# EAGLE design Sensor (EAGLE 7.3.0)
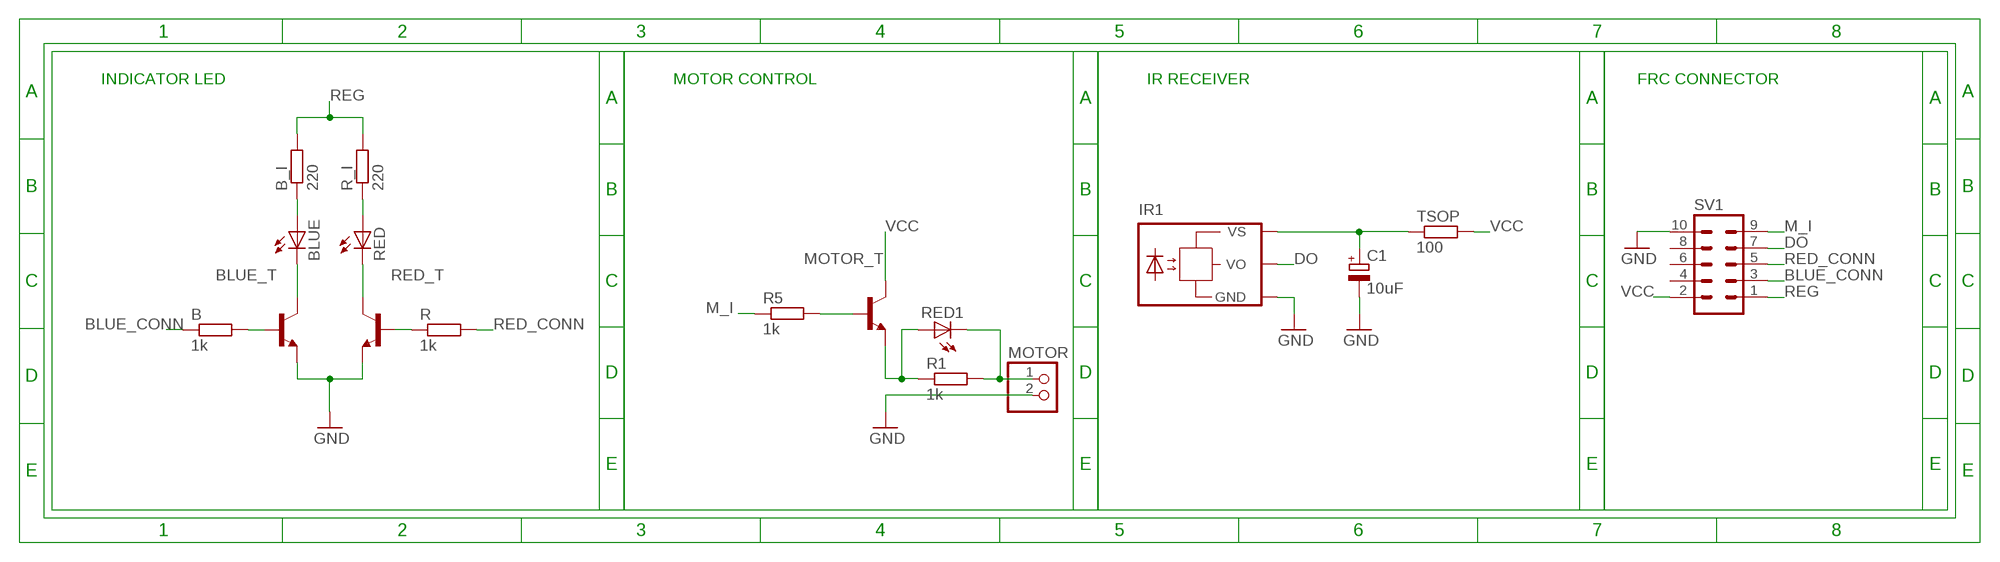
[diagram p0: schematic, sheet 1]

## Parts
B  1k  R-EU_0207/12  [0207/12]
B_I  220  R-EU_0207/12  [0207/12]
BLUE  LED5MM  [LED5MM]
BLUE_T  BC547  [TO92]
C1  10uF  CPOL-EUE2.5-6  [E2,5-6]
IR1  TSOP1730TB1  [TSOP17_TB1]
MOTOR  PINHD-1X2  [1X02]
MOTOR_T  BC547  [TO92]
R  1k  R-EU_0207/12  [0207/12]
R1  1k  R-EU_0207/12  [0207/12]
R5  1k  R-EU_0207/12  [0207/12]
R_I  220  R-EU_0207/12  [0207/12]
RED  LED5MM  [LED5MM]
RED1  LEDSMT1206  [1206]
RED_T  BC547  [TO92]
SV1  ML10  [ML10]
TSOP  100  R-EU_0207/12  [0207/12]

## Nets
BLUE_CONN: B.1 SV1.3
DO: IR1.VO SV1.7
GND: BLUE_T.1(E) C1.- IR1.GND MOTOR.2 RED_T.1(E) SV1.10
M_I: R5.1 SV1.9
N$1: B_I.1 BLUE.A
N$2: C1.+ IR1.VS TSOP.1
N$3: BLUE.K(C) BLUE_T.3(C)
N$4: RED.K(C) RED_T.3(C)
N$5: MOTOR_T.2(B) R5.2
N$6: MOTOR_T.1(E) R1.1 RED1.A
N$7: B.2 BLUE_T.2(B)
N$8: R.1 RED_T.2(B)
N$9: MOTOR.1 R1.2 RED1.C
R_I: R_I.1 RED.A
RED_CONN: R.2 SV1.5
REG: B_I.2 R_I.2 SV1.1
VCC: MOTOR_T.3(C) SV1.2 TSOP.2
Unconnected: SV1.4 SV1.6 SV1.8

## Notes on the sheet
- INDICATOR LED | MOTOR CONTROL | IR RECEIVER | FRC CONNECTOR

## Library data of the parts
B B_I R R1 R5 R_I TSOP = rcl:R-EU_: RESISTOR, European symbol
BLUE RED RED1 = led:LED: LED OSRAM: - CHIPLED LG R971, LG N971, LY N971, LG Q971, LY Q971, LO R971, LY R971 LH N974, LH R974 LS Q976, LO Q976, LY Q976 LO Q996 - Hyper CHIPLED LW Q18S LB Q993, LB Q99A, LB R99A - SideLED LS A670, LO A670, LY A670, LG A670, LP A670 LB A673, LV A673, LT A673, LW A673 LH A674 LY A675 LS A676, LA A676, LO A676, LY A676, LW A676 LS A679, LY A679, LG A679 - Hyper Micro SIDELED® LS Y876, LA Y876, LO Y876, LY Y876 LT Y87S - SmartLED LW L88C, LW L88S LB L89C, LB L89S, LG L890 LS L89K, LO L89K, LY L89K LS L896, LA L896, LO L896, LY L896 - TOPLED LS T670, LO T670, LY T670, LG T670, LP T670 LSG T670, LSP T670, LSY T670, LOP T670, LYG T670 LG T671, LOG T671, LSG T671 LB T673, LV T673, LT T673, LW T673 LH T674 LS T676, LA T676, LO T676, LY T676, LB T676, LH T676, LSB T676, LW T676 LB T67C, LV T67C, LT T67C, LS T67K, LO T67K, LY T67K, LW E67C LS E67B, LA E67B, LO E67B, LY E67B, LB E67C, LV E67C, LT E67C LW T67C LS T679, LY T679, LG T679 LS T770, LO T770, LY T770, LG T770, LP T770 LB T773, LV T773, LT T773, LW T773 LH T774 LS E675, LA E675, LY E675, LS T675 LS T776, LA T776, LO T776, LY T776, LB T776 LHGB T686 LT T68C, LB T68C - Hyper Mini TOPLED® LB M676 - Mini TOPLED Santana® LG M470 LS M47K, LO M47K, LY M47K Source: http://www.osram.convergy.de LUXEON: - LUMILED® LXK2-PW12-R00, LXK2-PW12-S00, LXK2-PW14-U00, LXK2-PW14-V00 LXK2-PM12-R00, LXK2-PM12-S00, LXK2-PM14-U00 LXK2-PE12-Q00, LXK2-PE12-R00, LXK2-PE12-S00, LXK2-PE14-T00, LXK2-PE14-U00 LXK2-PB12-K00, LXK2-PB12-L00, LXK2-PB12-M00, LXK2-PB14-N00, LXK2-PB14-P00, LXK2-PB14-Q00 LXK2-PR12-L00, LXK2-PR12-M00, LXK2-PR14-Q00, LXK2-PR14-R00 LXK2-PD12-Q00, LXK2-PD12-R00, LXK2-PD12-S00 LXK2-PH12-R00, LXK2-PH12-S00 LXK2-PL12-P00, LXK2-PL12-Q00, LXK2-PL12-R00 Source: www.luxeon.com KINGBRIGHT: KA-3528ASYC Source: www.kingbright.com
BLUE_T MOTOR_T RED_T = transistor:BC547: NPN TRANSISTOR
C1 = resistor:CPOL-EU: POLARIZED CAPACITOR, European symbol
IR1 = telefunken:TSOP17*TB1: TSOP17..TB1 IR Receiver Modules for Remote Control Systems Source: http://www.vishay.com/docs/82042/82042.pdf; OC_FARNELL: unknown; OC_NEWARK: unknown
MOTOR = pinhead:PINHD-1X2: PIN HEADER
SV1 = con-harting-ml:ML10: HARTING; OC_FARNELL: unknown; OC_NEWARK: unknown

## Board
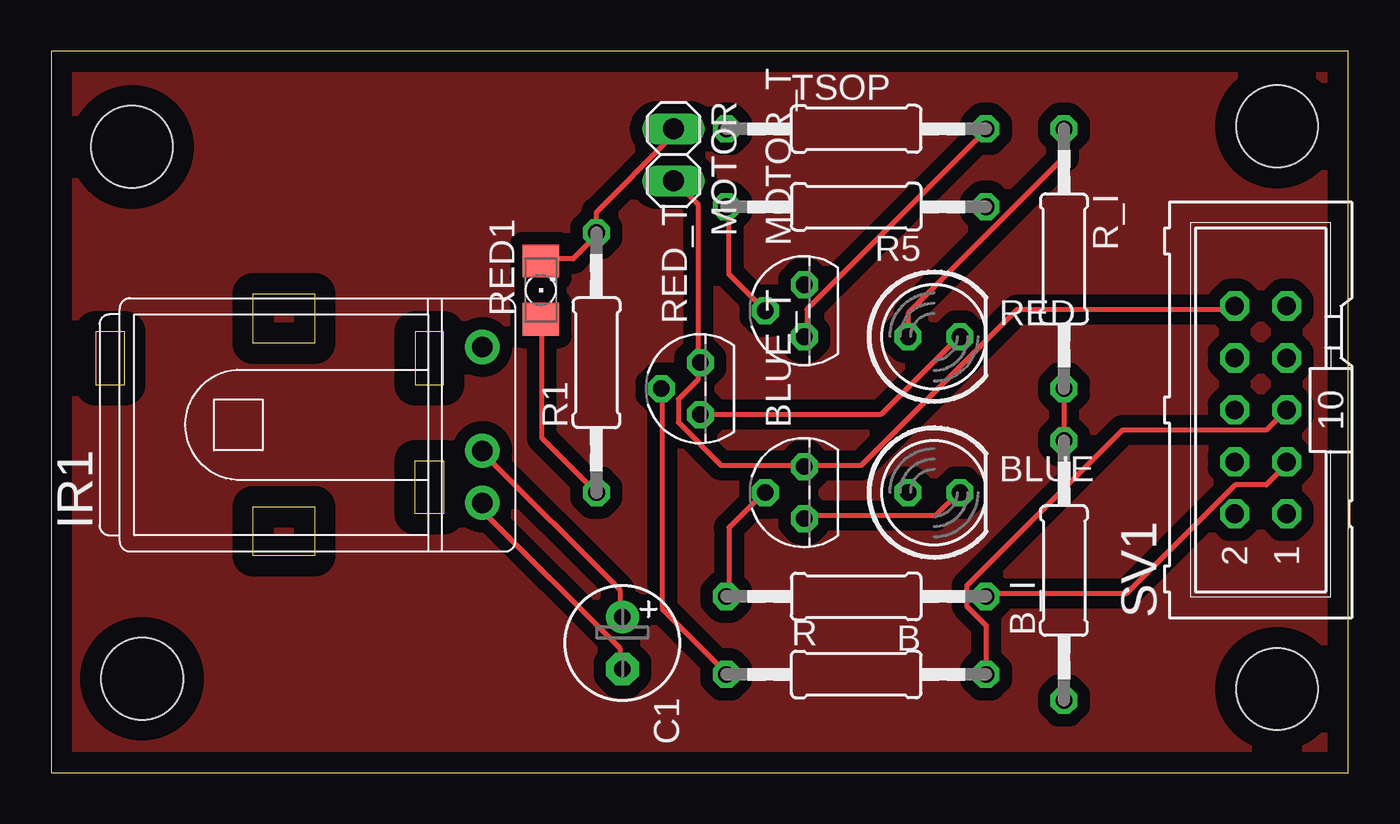
[diagram p1: board, top side]
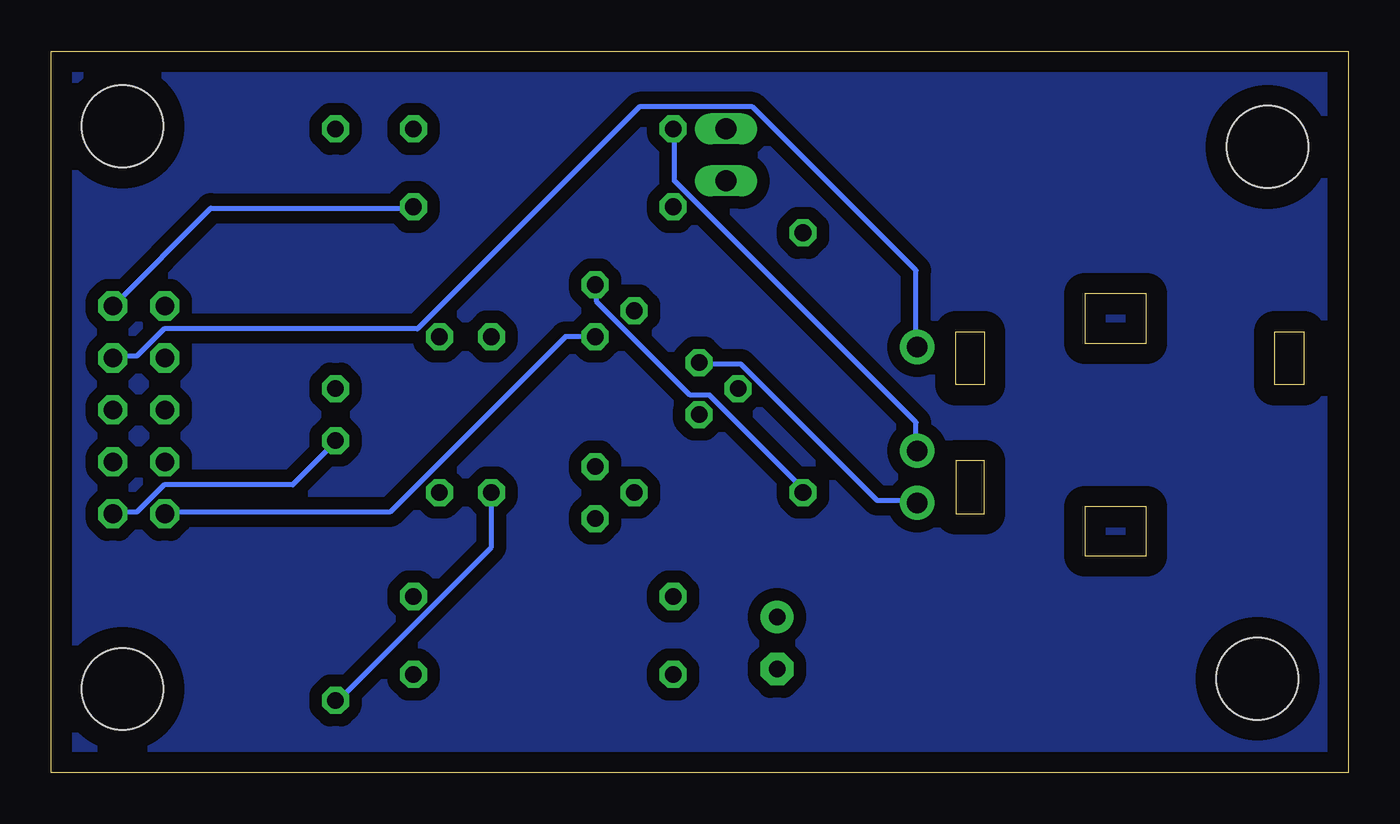
[diagram p2: board, bottom side, seen from below]

Size 63.44 x 35.28 mm. Coordinates in mm from the lower left corner, seen from the top.
Outline: 0,0 63.44,0 63.44,35.28 0,35.28 0,0
Copper layers (1*16): Top 0.035mm / dielectric 1.5mm / Bottom 0.035mm
Design rules "default *": minimum track width 10mil, minimum drill 24mil, track to track 5mil, track to pad 5mil, pad to pad 5mil, via to via 5mil, smd to smd 5mil, copper to edge 40mil, drill to drill 5mil, minimum pad ring 10mil, minimum via ring 8mil, stop-mask expansion 4mil, vias tented up to drill 0mil, thermal gap 10mil
Holes 4 mm at 3.95,30.6 4.45,4.6 59.95,31.6 59.95,4.1

### Footprints (pad centres in the part's own frame; a part is rotated, then mirrored left to right if it is on the bottom)
0207/12 = drill 0.813 octagon: 1 -6.35,0; 2 6.35,0
LED5MM = drill 0.813 octagon: A -1.27,0; K 1.27,0
TO92 = drill 0.813 octagon: 1 1.27,0; 2 0,1.905; 3 -1.27,0
E2,5-6 = drill 0.813 pad 1.6: + -1.27,0 | drill 0.813 pad 1.6 octagon: - 1.27,0
TSOP17_TB1 = drill 1 pad 1.676: GND 0,-3.81; VO 0,3.81; VS 0,-1.27
1X02 = drill 1.016 long: 1 -1.27,0; 2 1.27,0
1206 = smd 1.6 x 1.803: A -1.422,0; C 1.422,0
ML10 = drill 0.914 octagon: 1 -5.08,-1.27; 2 -5.08,1.27; 3 -2.54,-1.27; 4 -2.54,1.27; 5 0,-1.27; 6 0,1.27; 7 2.54,-1.27; 8 2.54,1.27; 9 5.08,-1.27; 10 5.08,1.27

### Placement (x,y rotation side)
B  39.37,8.62 180 top
B_I  49.53,9.89 90 top
BLUE  43.18,13.7 0 top
BLUE_T  36.83,13.7 90 top
C1  27.94,6.35 270 top
IR1  21.09,17.01 0 top
MOTOR  30.44,30.21 270 top
MOTOR_T  36.83,22.59 90 top
R  39.37,4.81 0 top
R1  26.67,20.05 90 top
R5  39.37,27.67 180 top
R_I  49.53,25.13 270 top
RED  43.18,21.32 0 top
RED1  23.95,23.6 90 top
RED_T  31.75,18.78 90 top
SV1  59.15,17.74 90 top
TSOP  39.37,31.48 0 top

### Tracks (layer width: path | path; a pad name or v marks a point on that pad's centre or on a via)
BLUE_CONN
  Top 0.254: B.1 45.72,8.75 52.58,8.75 57.91,14.08 59.44,14.08 60.39,15.03 SV1.3
DO
  Bottom 0.254: SV1.7 60.39,20.37 59.25,20.37 57.91,21.7 45.53,21.7 34.67,32.56 29.15,32.56 21.15,24.56 21.15,20.94 IR1.VO
GND
  Top 0.254: C1.- 27.81,5.13 27.81,6.08 21.15,12.75 21.15,13.13 IR1.GND | MOTOR.2 30.48,28.94 31.62,27.8 31.62,20.18 RED_T.1 31.62,19.99 31.62,19.22 30.67,18.27 30.67,17.13 32.77,15.03 36.77,15.03 BLUE_T.1 36.96,15.03 39.62,15.03 47.24,22.65 57.72,22.65 SV1.10
  Bottom 0.254: IR1.GND 21.15,13.32 23.05,13.32 29.72,19.99 31.62,19.99 RED_T.1
M_I
  Bottom 0.254: R5.1 45.72,27.61 55.63,27.61 60.39,22.84 SV1.9
N$1
  Bottom 0.254: BLUE.A 41.91,11.03 49.53,3.41 B_I.1
N$2
  Top 0.254: C1.+ 27.81,7.79 27.81,8.94 21.15,15.61 IR1.VS
  Bottom 0.254: TSOP.1 32.96,31.42 32.96,28.94 21.15,17.13 21.15,15.8 IR1.VS
N$3
  Top 0.254: BLUE_T.3 36.96,12.56 43.24,12.56 44.39,13.7 BLUE.K
N$4
  Top 0.254: RED_T.3 40.58,17.51 44.39,21.32 RED.K
N$5
  Top 0.254: MOTOR_T.2 33.15,24.37 33.15,27.61 R5.2
N$6
  Top 0.254: R1.1 24,16.37 24,22.08 RED1.A
  Bottom 0.254: R1.1 26.67,13.89 31.24,18.46 32.19,18.46 36.77,23.03 36.77,23.8 MOTOR_T.1
N$7
  Top 0.254: B.2 33.15,8.75 33.15,11.99 34.86,13.7 BLUE_T.2
N$8
  Top 0.254: RED_T.2 29.91,18.65 29.91,7.98 32.96,4.94 R.1
N$9
  Top 0.254: RED1.C 24,25.13 25.53,25.13 26.67,26.27 R1.2 26.67,27.42 30.29,31.04 30.29,31.42 MOTOR.1
N$10
  pour Top (isolate 0.61): 0.45,34.6 0.45,0.6 62.95,0.6 62.95,34.6
N$11
  pour Bottom (isolate 0.61): 0.45,34.6 0.45,0.6 62.95,0.6 62.95,34.6
R_I
  Top 0.254: RED.A 41.91,22.46 49.53,30.08 R_I.1
RED_CONN
  Top 0.254: R.2 45.72,7.22 44.77,8.18 44.77,9.13 52.39,16.75 59.44,16.75 60.39,17.7 SV1.5
REG
  Top 0.254: R_I.2 B_I.2
  Bottom 0.254: SV1.1 60.39,12.75 59.25,12.75 57.91,14.08 51.62,14.08 49.53,16.18 B_I.2
VCC
  Top 0.254: MOTOR_T.3 36.96,21.32 36.96,22.65 45.72,31.42 TSOP.2
  Bottom 0.254: MOTOR_T.3 38.29,21.32 46.86,12.75 57.72,12.75 SV1.2